# EAGLE design BMS (EAGLE 8.5.0)
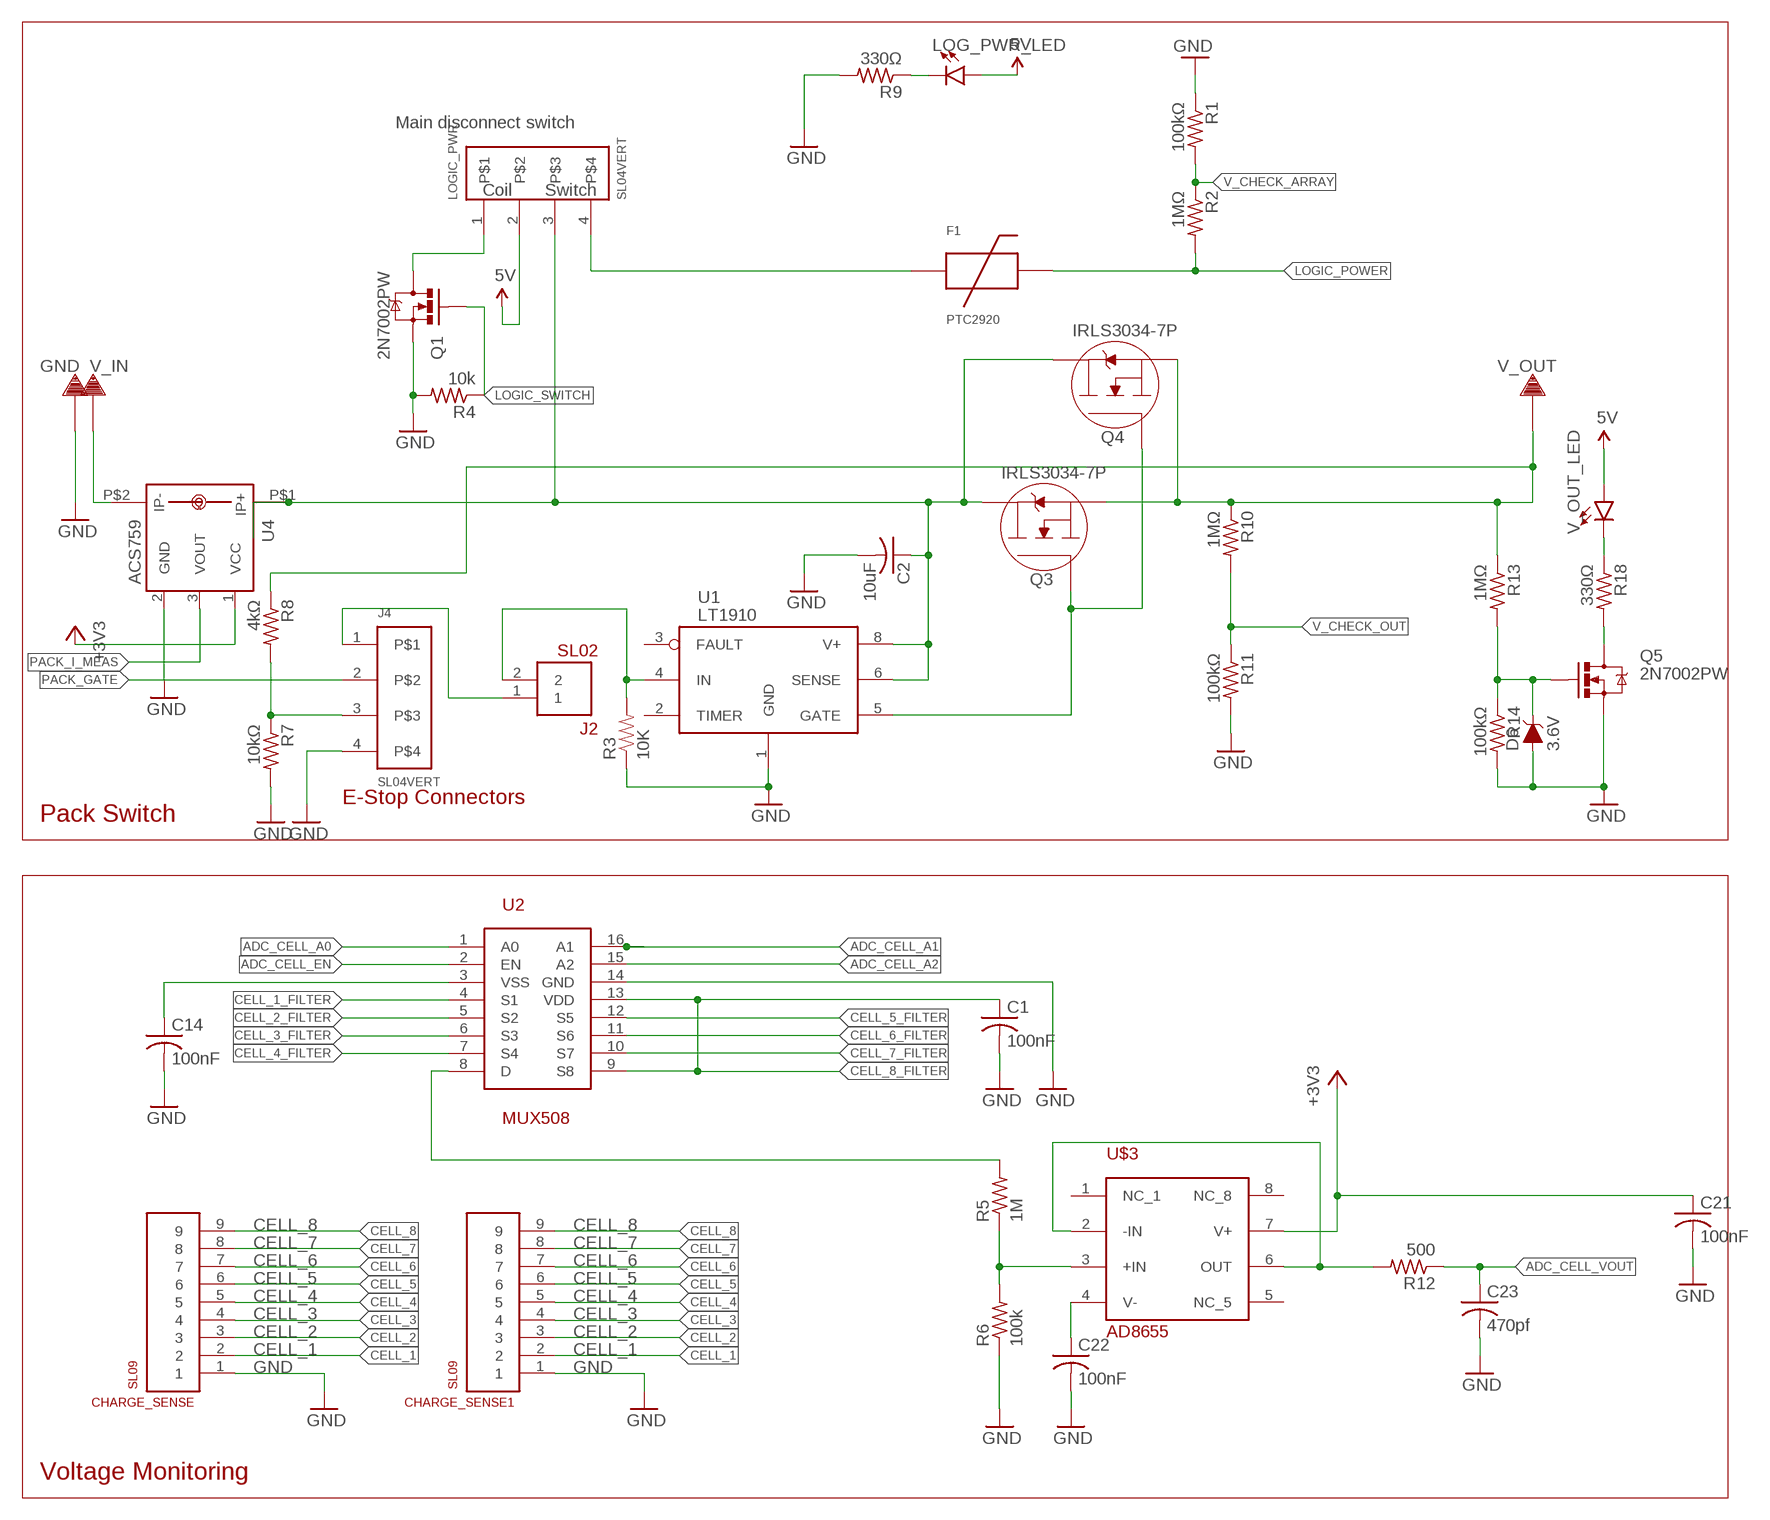
[diagram p0: schematic, sheet 1, part 1 of 2]
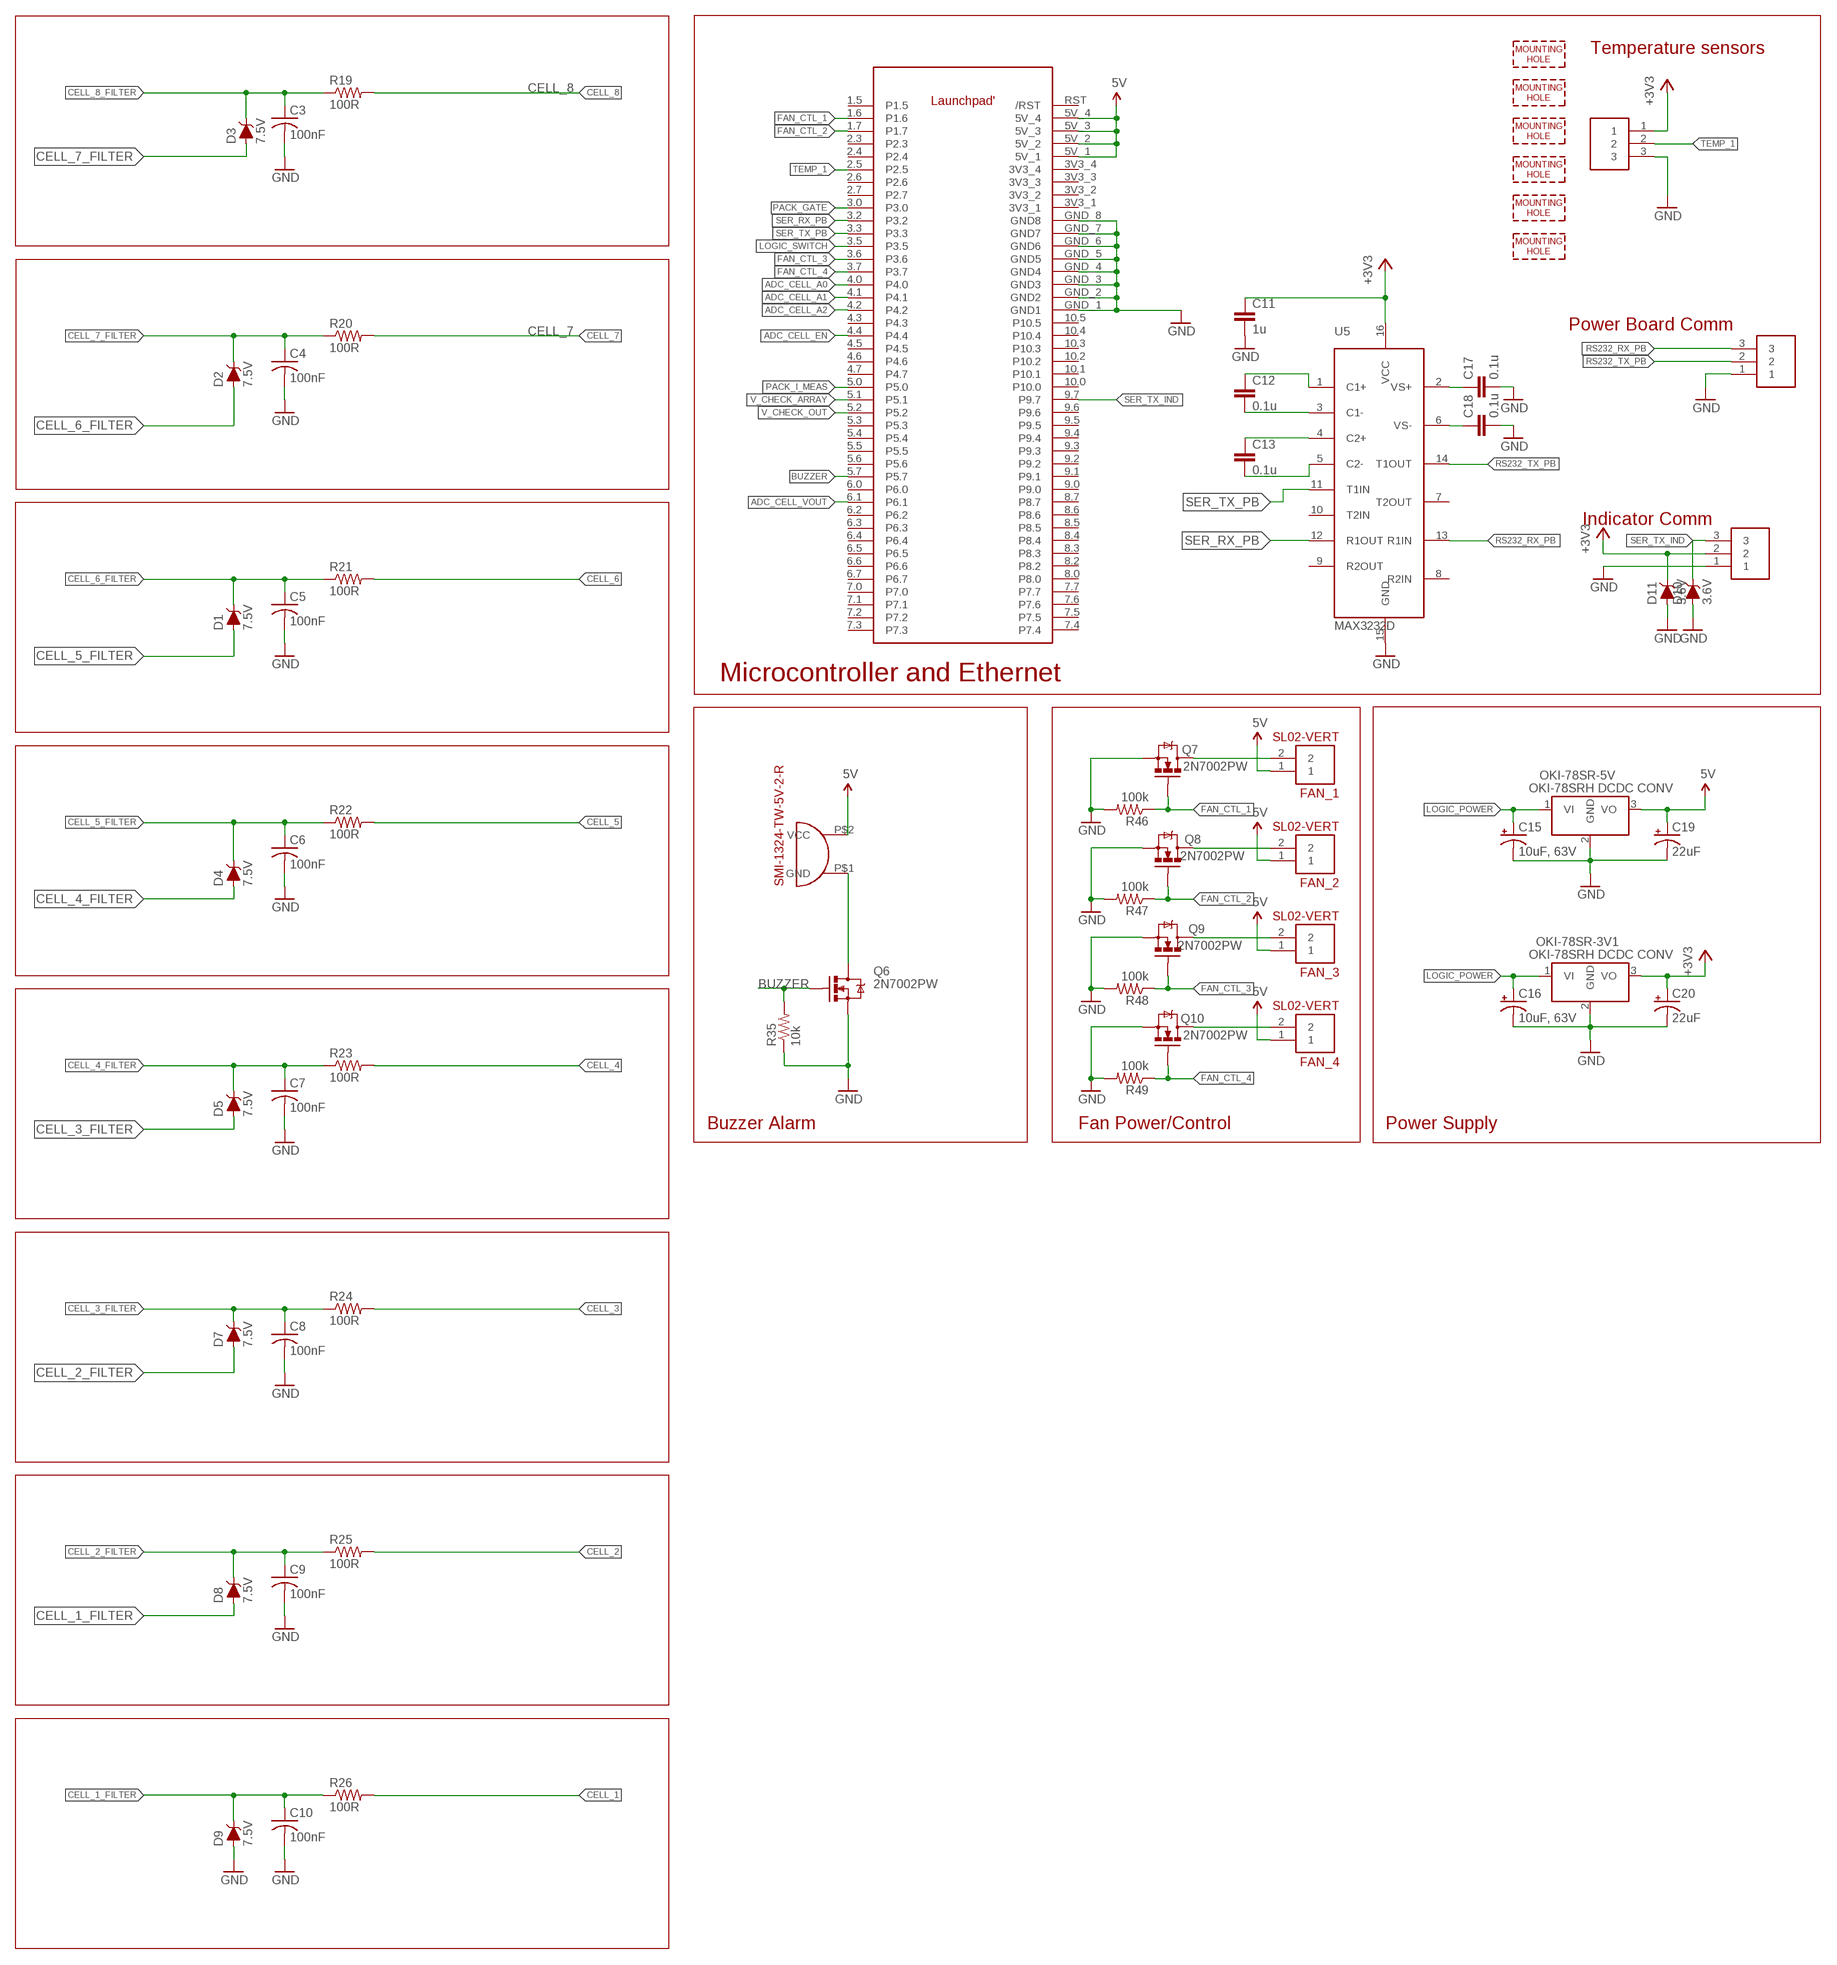
[diagram p1: schematic, sheet 1, part 2 of 2]

## Parts
C1  100nF  C-USC0603  [C0603]
C2  10uF  C-USC0805  [C0805]
C3  100nF  C-USC0603  [C0603]
C4  100nF  C-USC0603  [C0603]
C5  100nF  C-USC0603  [C0603]
C6  100nF  C-USC0603  [C0603]
C7  100nF  C-USC0603  [C0603]
C8  100nF  C-USC0603  [C0603]
C9  100nF  C-USC0603  [C0603]
C10  100nF  C-USC0603  [C0603]
C11  1u  CAP0805  [0805]
C12  0.1u  CAP0805  [0805]
C13  0.1u  CAP0805  [0805]
C14  100nF  C-USC0603  [C0603]
C15  10uF, 63V  CPOL-USD  [PANASONIC_D]
C16  10uF, 63V  CPOL-USD  [PANASONIC_D]
C17  0.1u  CAP0805  [0805]
C18  0.1u  CAP0805  [0805]
C19  22uF  CPOL-USD  [PANASONIC_D]
C20  22uF  CPOL-USD  [PANASONIC_D]
C21  100nF  C-USC0603  [C0603]
C22  100nF  C-USC0603  [C0603]
C23  470pf  C-USC0603  [C0603]
CHARGE_SENSE  SL09  [MOLEX-70543-0008]
CHARGE_SENSE1  SL09  [MOLEX-70543-0008]
D1  7.5V  DIODE-ZENER-BZT52C3V6S  [SOD-323]
D2  7.5V  DIODE-ZENER-BZT52C3V6S  [SOD-323]
D3  7.5V  DIODE-ZENER-BZT52C3V6S  [SOD-323]
D4  7.5V  DIODE-ZENER-BZT52C3V6S  [SOD-323]
D5  7.5V  DIODE-ZENER-BZT52C3V6S  [SOD-323]
D6  3.6V  DIODE-ZENER-BZT52C3V6S  [SOD-323]
D7  7.5V  DIODE-ZENER-BZT52C3V6S  [SOD-323]
D8  7.5V  DIODE-ZENER-BZT52C3V6S  [SOD-323]
D9  7.5V  DIODE-ZENER-BZT52C3V6S  [SOD-323]
D10  3.6V  DIODE-ZENER-BZT52C3V6S  [SOD-323]
D11  3.6V  DIODE-ZENER-BZT52C3V6S  [SOD-323]
F1  PTC2920  [2920]
FAN_1  SL02-VERT  [MOLEX-70543-0001]
FAN_2  SL02-VERT  [MOLEX-70543-0001]
FAN_3  SL02-VERT  [MOLEX-70543-0001]
FAN_4  SL02-VERT  [MOLEX-70543-0001]
GND  TERMINAL_HOLE  [LARGE_TERMINAL_HOLE]
H1  MOUNTING_HOLE#4  [#4_SCREW]
H2  MOUNTING_HOLE#4  [#4_SCREW]
H3  MOUNTING_HOLE#4  [#4_SCREW]
H4  MOUNTING_HOLE#4  [#4_SCREW]
H5  MOUNTING_HOLE#4  [#4_SCREW]
H6  MOUNTING_HOLE#4  [#4_SCREW]
IC2  SMI-1324-TW-5V-2-R  [SMI-1324-TW-5V-2-R]
J1  SL03  [MOLEX-70543-0002]
J2  SL02  [MOLEX-70543-0001]
J4  SL04VERT  [MOLEX-70543-0003]
LOG_PWR_LED  LED1206  [LED-1206]
LOGIC_PWR  SL04VERT  [MOLEX-70543-0003]
OKI-78SR-3V1  Q_OKI-78SR12  Q_OKI-78SR  [OKI-78SRH]
OKI-78SR-5V  Q_OKI-78SR5  Q_OKI-78SR  [OKI-78SRH]
Q1  2N7002PW  MOSFET-NCHANNEL2N7002PW  [SOT323]
Q3  IRLS3034-7P  [D2PAK-7]
Q4  IRLS3034-7P  [D2PAK-7]
Q5  2N7002PW  MOSFET-NCHANNEL2N7002PW  [SOT323]
Q6  2N7002PW  MOSFET-NCHANNEL2N7002PW  [SOT323]
Q7  2N7002PW  MOSFET-NCHANNEL2N7002PW  [SOT323]
Q8  2N7002PW  MOSFET-NCHANNEL2N7002PW  [SOT323]
Q9  2N7002PW  MOSFET-NCHANNEL2N7002PW  [SOT323]
Q10  2N7002PW  MOSFET-NCHANNEL2N7002PW  [SOT323]
R1  100kΩ  R-US_R0805  [R0805]
R2  1MΩ  R-US_R0805  [R0805]
R3  10K  10KOHM-1/10W-1%(0603)0603  [0603-RES]
R4  10k  R-US_R0805  [R0805]
R5  1M  R-US_M1206  [M1206]
R6  100k  R-US_M1206  [M1206]
R7  10kΩ  R-US_R0805  [R0805]
R8  4kΩ  R-US_R0805  [R0805]
R9  330Ω  R-US_R0805  [R0805]
R10  1MΩ  R-US_R0805  [R0805]
R11  100kΩ  R-US_R0805  [R0805]
R12  500  R-US_M1206  [M1206]
R13  1MΩ  R-US_R0805  [R0805]
R14  100kΩ  R-US_R0805  [R0805]
R18  330Ω  R-US_R0805  [R0805]
R19  100R  R-US_R0603  [R0603]
R20  100R  R-US_R0603  [R0603]
R21  100R  R-US_R0603  [R0603]
R22  100R  R-US_R0603  [R0603]
R23  100R  R-US_R0603  [R0603]
R24  100R  R-US_R0603  [R0603]
R25  100R  R-US_R0603  [R0603]
R26  100R  R-US_R0603  [R0603]
R35  10k  R-US_R0805  [R0805]
R46  100k  R-US_R0805  [R0805]
R47  100k  R-US_R0805  [R0805]
R48  100k  R-US_R0805  [R0805]
R49  100k  R-US_R0805  [R0805]
RS232_PB  SL03  [MOLEX-70543-0002]
TEMP_1  SL03  [MOLEX-70543-0002]
U1  LT1910  [SO8]
U2  MUX508  [SOIC16]
U3  MSP430R401R  [MSP432R401R-LAUNCHPAD]
U4  ACS759  [ACS-PFF-LEADFORM]
U5  MAX3232D  [SOIC16]
U$3  AD8655  [SOIC8]
V_IN  TERMINAL_HOLE  [LARGE_TERMINAL_HOLE]
V_OUT  TERMINAL_HOLE  [LARGE_TERMINAL_HOLE]
V_OUT_LED  LED1206  [LED-1206]

## Nets
5V: C19.+ FAN_1.1 FAN_2.1 FAN_3.1 FAN_4.1 IC2.P$2(VCC) LOG_PWR_LED.A LOGIC_PWR.2 OKI-78SR-5V.3(VO) U3.5V_1 U3.5V_2 U3.5V_3 U3.5V_4 V_OUT_LED.A
+3V3: C11.1 C20.+ C21.1 D11.C J1.2 OKI-78SR-3V1.3(VO) TEMP_1.1 U4.1(VCC) U5.16(VCC) U$3.7(V+)
ADC_CELL_A0: U2.1(A0) U3.4.0
ADC_CELL_A1: U2.16(A1) U3.4.1
ADC_CELL_A2: U2.15(A2) U3.4.2
ADC_CELL_EN: U2.2(EN) U3.4.4
ADC_CELL_VIN: R5.1 R6.2 U$3.3(+IN)
ADC_CELL_VOUT: C23.1 R12.1 U3.6.1
BUZZER: Q6.1(G) R35.2 U3.5.7
CELL_1: CHARGE_SENSE1.2 CHARGE_SENSE.2 R26.2
CELL_1_FILTER: C10.1 D8.A D9.C R26.1 U2.4(S1)
CELL_2: CHARGE_SENSE1.3 CHARGE_SENSE.3 R25.2
CELL_2_FILTER: C9.1 D7.A D8.C R25.1 U2.5(S2)
CELL_3: CHARGE_SENSE1.4 CHARGE_SENSE.4 R24.2
CELL_3_FILTER: C8.1 D5.A D7.C R24.1 U2.6(S3)
CELL_4: CHARGE_SENSE1.5 CHARGE_SENSE.5 R23.2
CELL_4_FILTER: C7.1 D4.A D5.C R23.1 U2.7(S4)
CELL_5: CHARGE_SENSE1.6 CHARGE_SENSE.6 R22.2
CELL_5_FILTER: C6.1 D1.A D4.C R22.1 U2.12(S5)
CELL_6: CHARGE_SENSE1.7 CHARGE_SENSE.7 R21.2
CELL_6_FILTER: C5.1 D1.C D2.A R21.1 U2.11(S6)
CELL_7: CHARGE_SENSE1.8 CHARGE_SENSE.8 R20.2
CELL_7_FILTER: C4.1 D2.C D3.A R20.1 U2.10(S7)
CELL_8: CHARGE_SENSE1.9 CHARGE_SENSE.9 R19.2
CELL_8_FILTER: C1.1 C3.1 D3.C R19.1 U2.9(S8) U2.13(VDD)
FAN_CTL_1: Q7.1(G) R46.1 U3.1.6
FAN_CTL_2: Q8.1(G) R47.1 U3.1.7
FAN_CTL_3: Q9.1(G) R48.1 U3.3.6
FAN_CTL_4: Q10.1(G) R49.1 U3.3.7
GND: C1.2 C2.2 C3.2 C4.2 C5.2 C6.2 C7.2 C8.2 C9.2 C10.2 C11.2 C14.2 C15.- C16.- C17.2 C18.2 C19.- C20.- C21.2 C22.2 C23.2 CHARGE_SENSE1.1 CHARGE_SENSE.1 D6.A D9.A D10.A D11.A GND.P$1 J1.1 J4.4 OKI-78SR-3V1.2(GND) OKI-78SR-5V.2(GND) Q1.2(S) Q5.2(S) Q6.2(S) Q7.2(S) Q8.2(S) Q9.2(S) Q10.2(S) R1.1 R3.1 R4.2 R6.1 R7.2 R9.2 R11.2 R14.2 R35.1 R46.2 R47.2 R48.2 R49.2 RS232_PB.1 TEMP_1.3 U1.1(GND) U2.14(GND) U3.GND_1(GND1) U3.GND_2(GND2) U3.GND_3(GND3) U3.GND_4(GND4) U3.GND_5(GND5) U3.GND_6(GND6) U3.GND_7(GND7) U3.GND_8(GND8) U4.2(GND) U5.15(GND)
LOGIC_POWER: C15.+ C16.+ F1.P$2 OKI-78SR-3V1.1(VI) OKI-78SR-5V.1(VI) R2.2
LOGIC_SWITCH: Q1.1(G) R4.1 U3.3.5
N$1: J2.1 J4.1
N$2: Q5.3(D) R18.2
N$3: C14.1 U2.3(VSS)
N$4: LOG_PWR_LED.C R9.1
N$5: J2.2 R3.2 U1.4(IN)
N$6: C22.1 U$3.4(V-)
N$7: LOGIC_PWR.1 Q1.3(D)
N$8: C13.1 U5.4(C2+)
N$9: R18.1 V_OUT_LED.C
N$10: D6.C Q5.1(G) R13.2 R14.1
N$11: J4.3 R7.1 R8.2
N$12: C13.2 U5.5(C2-)
N$14: C17.1 U5.2(VS+)
N$15: F1.P$1 LOGIC_PWR.4
N$22: R5.2 U2.8(D)
N$34: Q3.1(GATE) Q4.1(GATE) U1.5(GATE)
N$40: C12.1 U5.1(C1+)
N$41: C2.1 LOGIC_PWR.3 Q3.PAD(DRAIN) Q4.PAD(DRAIN) U1.6(SENSE) U1.8(V+) U4.P$1(IP+)
N$42: C12.2 U5.3(C1-)
N$45: C18.1 U5.6(VS-)
N$63: IC2.P$1(GND) Q6.3(D)
N$66: FAN_1.2 Q7.3(D)
N$70: FAN_2.2 Q8.3(D)
N$71: FAN_3.2 Q9.3(D)
N$72: FAN_4.2 Q10.3(D)
PACK_GATE: J4.2 U3.3.0
PACK_I_MEAS: U3.5.0 U4.3(VOUT)
RC_FILTER: R12.2 U$3.2(-IN) U$3.6(OUT)
RS232_RX_PB: RS232_PB.3 U5.13(R1IN)
RS232_TX_PB: RS232_PB.2 U5.14(T1OUT)
SER_RX_PB: U3.3.2 U5.12(R1OUT)
SER_TX_IND: D10.C J1.3 U3.9.7
SER_TX_PB: U3.3.3 U5.11(T1IN)
TEMP_1: TEMP_1.2 U3.2.5
V_CHECK_ARRAY: R1.2 R2.1 U3.5.1
V_CHECK_OUT: R10.2 R11.1 U3.5.2
V_IN: U4.P$2(IP-) V_IN.P$1
V_OUT: Q3.2(SOURCE) Q3.3(SOURCE) Q3.4(SOURCE) Q3.5(SOURCE) Q3.6(SOURCE) Q4.2(SOURCE) Q4.3(SOURCE) Q4.4(SOURCE) Q4.5(SOURCE) Q4.6(SOURCE) R8.1 R10.1 R13.1 V_OUT.P$1
Unconnected: U1.2(TIMER) U1.3(FAULT) U3.1.5 U3.2.3 U3.2.4 U3.2.6 U3.2.7 U3.3V3_1 U3.3V3_2 U3.3V3_3 U3.3V3_4 U3.4.3 U3.4.5 U3.4.6 U3.4.7 U3.5.3 U3.5.4 U3.5.5 U3.5.6 U3.6.0 U3.6.2 U3.6.3 U3.6.4 U3.6.5 U3.6.6 U3.6.7 U3.7.0 U3.7.1 U3.7.2 U3.7.3 U3.7.4 U3.7.5 U3.7.6 U3.7.7 U3.8.0 U3.8.2 U3.8.3 U3.8.4 U3.8.5 U3.8.6 U3.8.7 U3.9.0 U3.9.1 U3.9.2 U3.9.3 U3.9.4 U3.9.5 U3.9.6 U3.10.0 U3.10.1 U3.10.2 U3.10.3 U3.10.4 U3.10.5 U3.RST(/RST) U5.7(T2OUT) U5.8(R2IN) U5.9(R2OUT) U5.10(T2IN) U$3.1(NC_1) U$3.5(NC_5) U$3.8(NC_8)

## Notes on the sheet
- Temperature sensors
- Main disconnect switch
- Coil | Switch
- Power Board Comm
- Indicator Comm
- E-Stop Connectors
- Pack Switch
- Microcontroller and Ethernet
- Voltage Monitoring
- Buzzer Alarm | Fan Power/Control | Power Supply

## Library data of the parts
C1-C10 C14 C21-C23 = rcl:C-US: CAPACITOR, American symbol; SPICEPREFIX: C
C11-C13 C17 C18 = SparkFun-Passives:CAP: Capacitor Standard 0603 ceramic capacitor, and 0.1" leaded capacitor.
C15 C16 C19 C20 = rcl:CPOL-US: POLARIZED CAPACITOR, American symbol; SPICEPREFIX: C
CHARGE_SENSE CHARGE_SENSE1 = MRDT-Connectors:SL09
D1-D5 D7-D9 = SparkFun-DiscreteSemi:DIODE-ZENER: Zener Diode A Zener diode allows current to flow from its anode to its cathode like a normal semiconductor diode, but it also permits current to flow in the reverse direction when its "Zener voltage" is reached. - WIkipedia; PROD_ID: DIO-08199; VALUE: 3.6V
D6 D10 D11 = SparkFun-DiscreteSemi:DIODE-ZENER: Zener Diode A Zener diode allows current to flow from its anode to its cathode like a normal semiconductor diode, but it also permits current to flow in the reverse direction when its "Zener voltage" is reached. - WIkipedia; PROD_ID: DIO-08199
F1 = 2016PowerPackLibraries:PTC2920
FAN_1-FAN_4 = MRDT-Connectors:SL02-VERT
GND V_IN V_OUT = MRDT-2015-PowerBoard:TERMINAL_HOLE
H1-H6 = MRDT-Hardware:MOUNTING_HOLE: Mounting hole for M6 bolt. Standard use mounting hole for: Tiva C Connected - M6 Anderson Powerpole Mounting Wing - M8 Most frame-mounted PCB's - M8
IC2 = MRDT-2017-BMS:SMI-1324-TW-5V-2-R
J1 RS232_PB TEMP_1 = MRDT-Connectors:SL03: Molex 3-pin SL connector Locking 3 pin connector with standard header spacing. Backward compatible with standard RC servo connectors.
J2 = MRDT-Connectors:SL02
J4 LOGIC_PWR = MRDT-Connectors:SL04
LOG_PWR_LED V_OUT_LED = SparkFun-LED:LED: LED (Generic) Standard schematic elements and footprints for 5mm, 3mm, 1206, and 0603 sized LEDs. Generic LEDs with no color specified.
OKI-78SR-3V1 OKI-78SR-5V = MRDT-2015-PowerBoard:Q_OKI-78SR: 4.95W DC/DC Converter Manufacturer: Murata Part Number: OKI-78SR-5/1.5-W36H-C OKI-78SR-3.3/1.5-W36H-C
Q1 Q5-Q10 = SparkFun-DiscreteSemi:MOSFET-NCHANNEL: Common NMOSFET Parts MFG P/N Store ID Prod ID FDD8780 TRANS-09984 SI7820DN TRANS-11055 FDS6630A IC-08089 2N7002PW TRANS-11151 FQP30N06L COM-10213 TRANS-10060 BSS123LT1G TRANS-08345 BSS138 TRANS-00830 BS170 2N7000; PROD_ID: TRANS-11151
Q3 Q4 = MRDT-2015-BMS:IRLS3034-7P: High-current SMD MOSFET
R1 R2 R4-R14 R18-R26 R35 R46-R49 = rcl:R-US_: RESISTOR, American symbol; SPICEPREFIX: R
R3 = SparkFun-Resistors:10KOHM-1/10W-1%(0603): RES-00824; PROD_ID: RES-00824
U1 = MRDT-2015-PowerBoard:LT1910
U2 = MRDT-ICs:MUX508
U3 = MRDT-Microcontrollers:MSP430R401R
U4 = MRDT-ICs:ACS759
U5 = MRDT-ICs:MAX*232; OPERATING_VOLTAGE: 3V3
U$3 = MRDT-ICs:AD8655

## Net classes
0 default: width 0.406 mm, clearance 0.152 mm

## Board
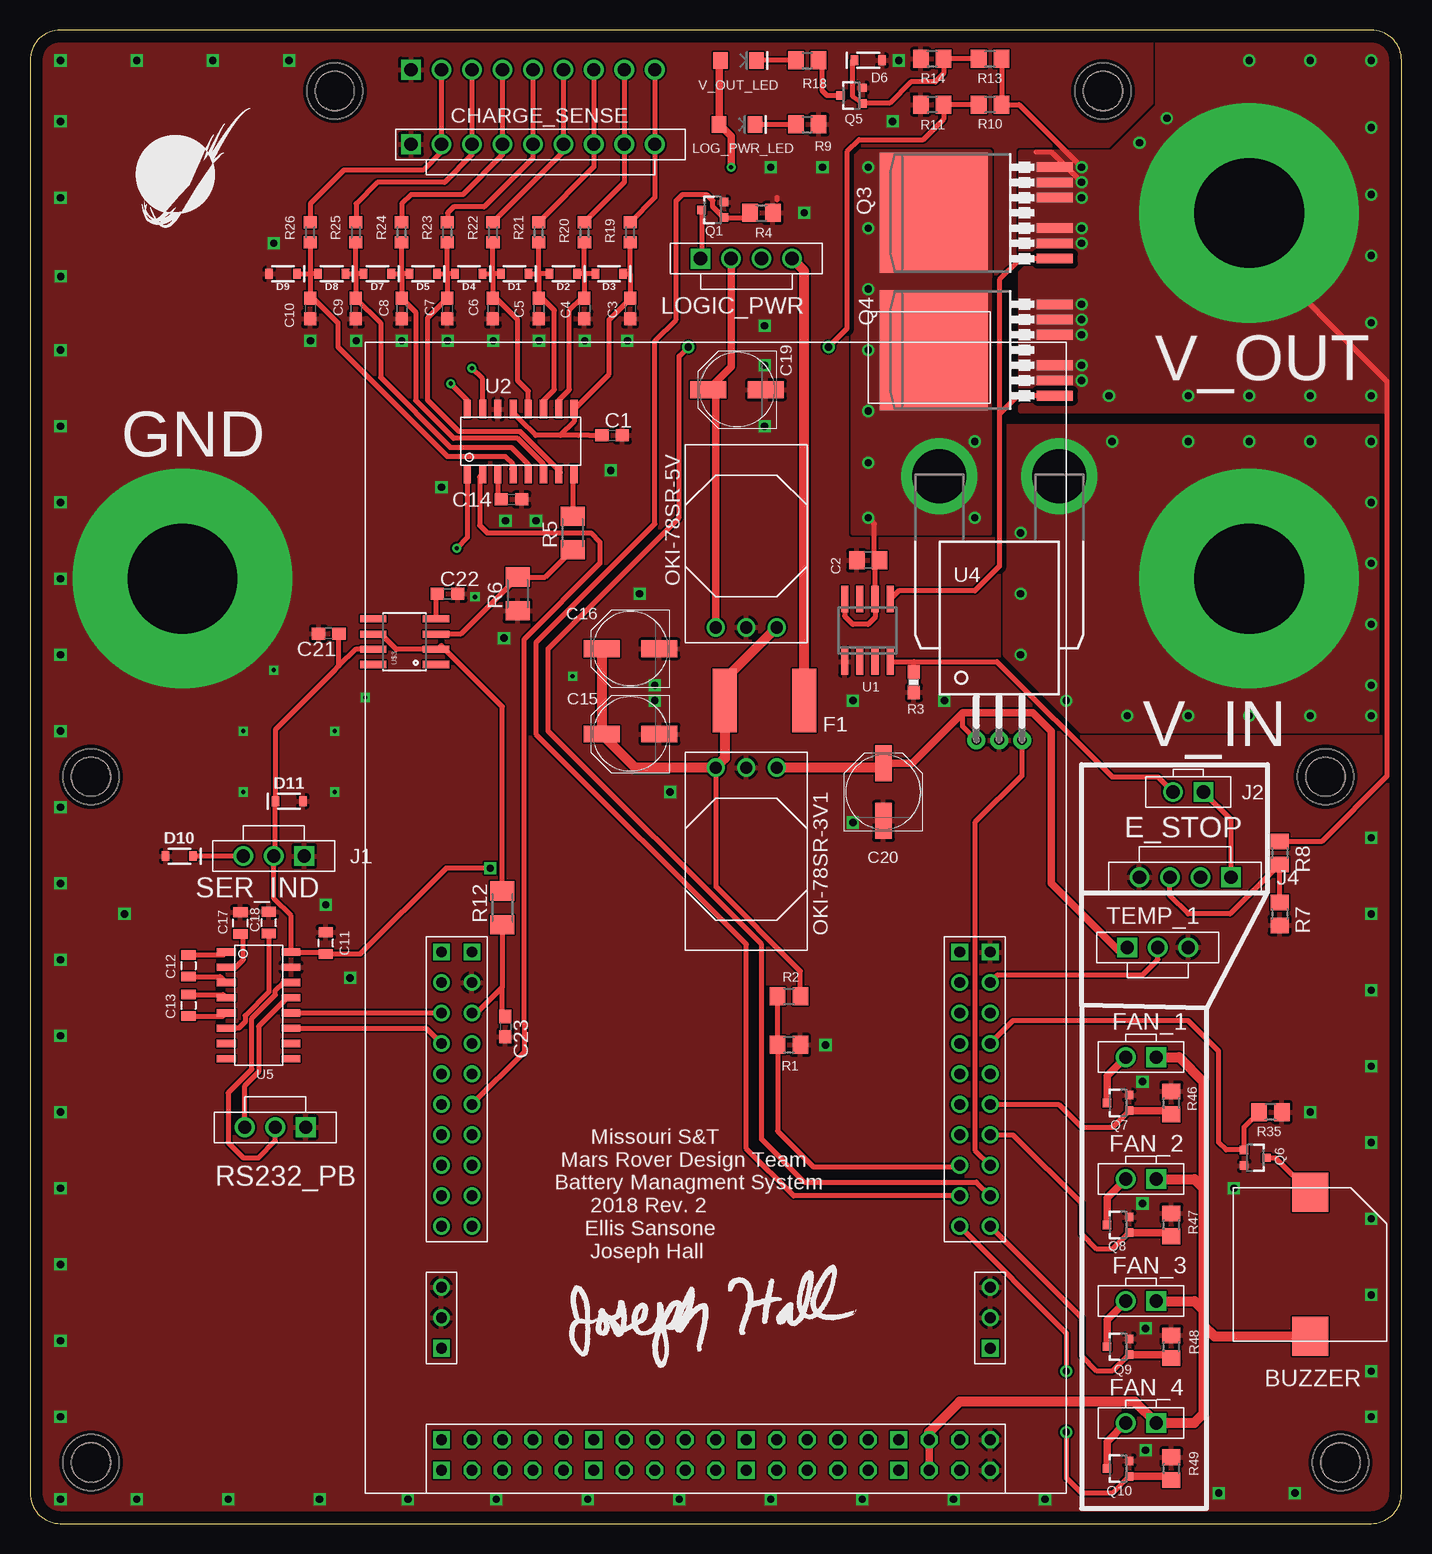
[diagram p2: board, top side]
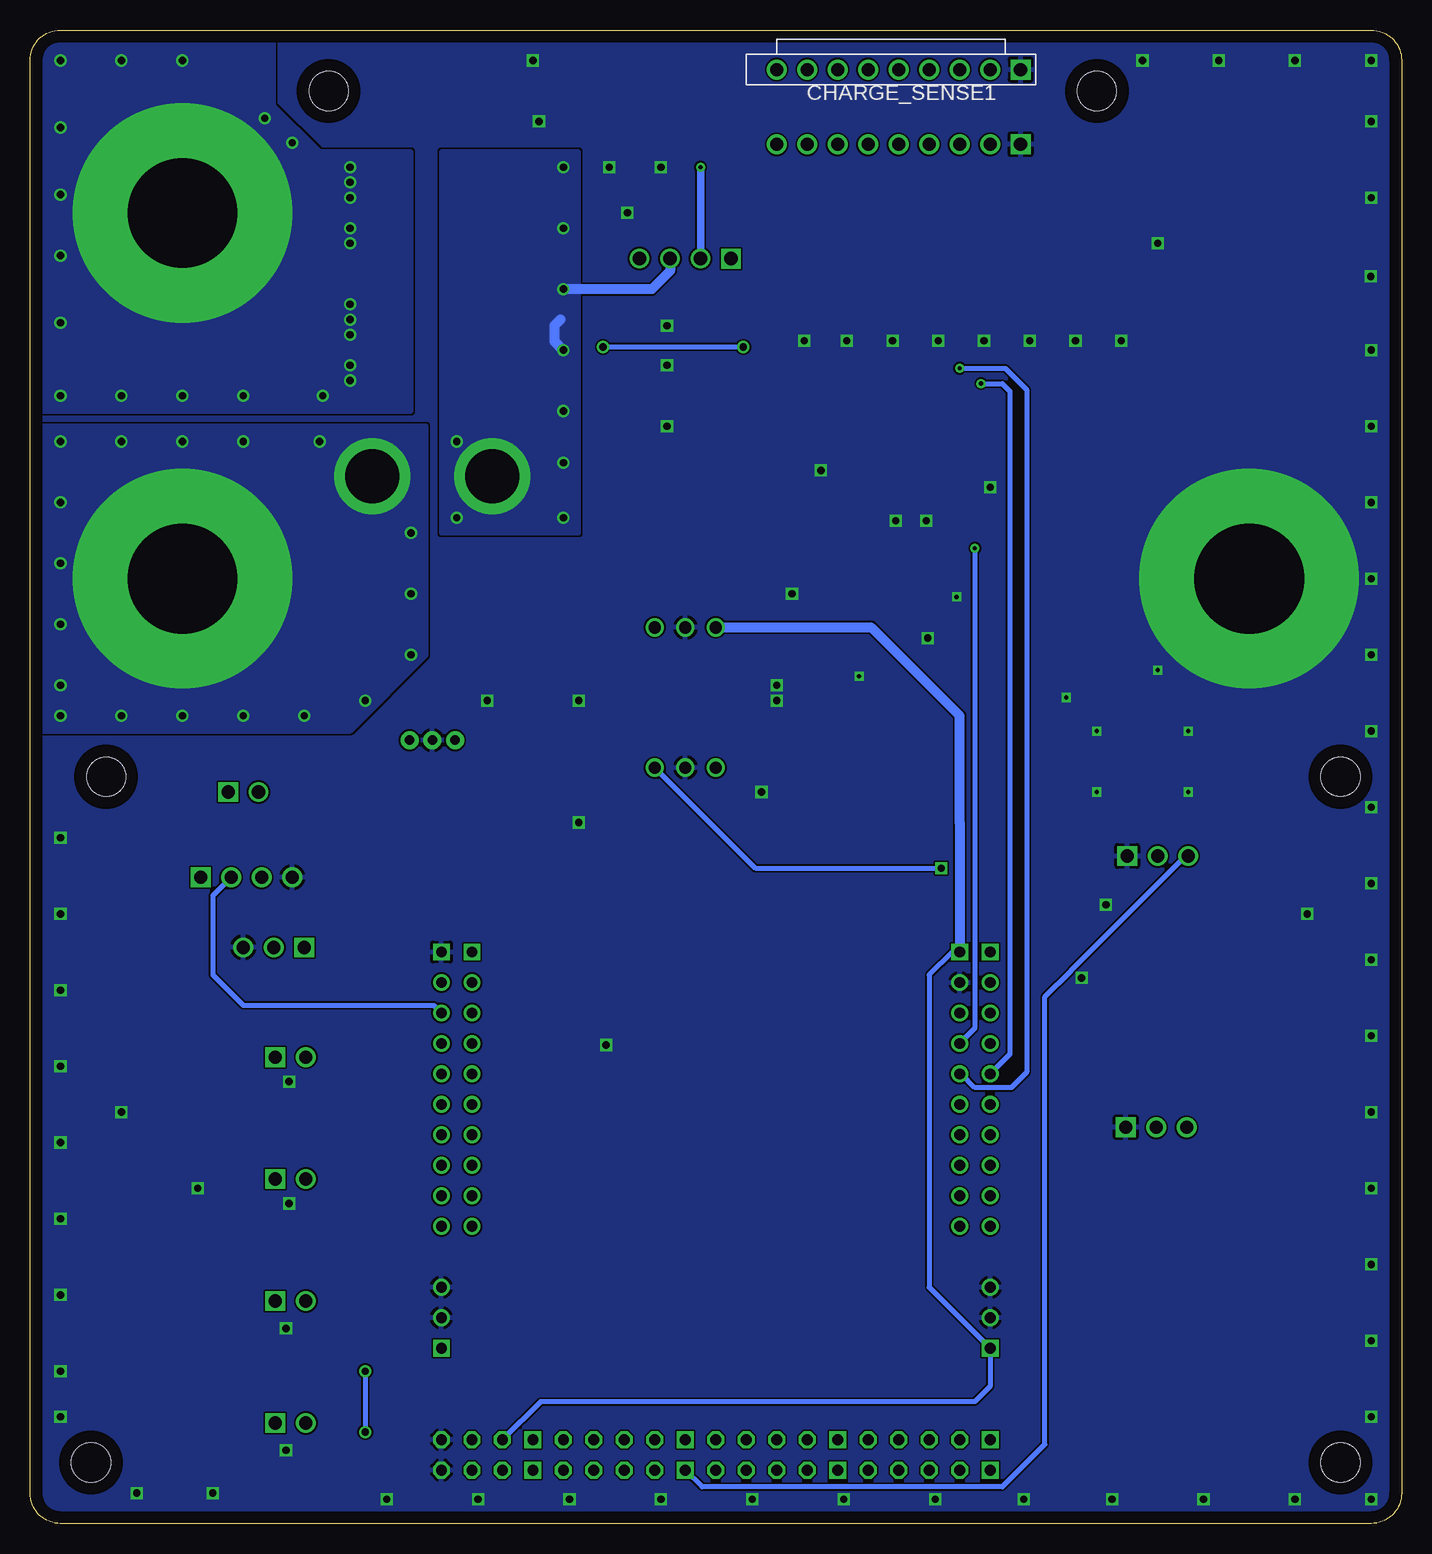
[diagram p3: board, bottom side, seen from below]

Size 114.3 x 124.46 mm. Coordinates in mm from the lower left corner, seen from the top.
Outline: 0,121.92 0,2.54 arc90 2.54,0 111.76,0 arc90 114.3,2.54 114.3,121.92 arc90 111.76,124.46 2.54,124.46 arc90 0,121.92
Copper layers (1*16): Top 0.035mm / dielectric 1.5mm / Bottom 0.035mm
Design rules "advanced_circuits_standard": minimum track width 5mil, minimum drill 10mil, track to track 5mil, track to pad 5mil, pad to pad 5mil, via to via 5mil, smd to smd 5mil, copper to edge 40mil, drill to drill 5mil, minimum pad ring 10mil, minimum via ring 8mil, stop-mask expansion 4mil, vias tented up to drill 0mil, thermal gap 10mil

### Footprints (pad centres in the part's own frame; a part is rotated, then mirrored left to right if it is on the bottom)
C0603 = smd 1.1 x 1: 1 -0.85,0; 2 0.85,0
C0805 = smd 1.3 x 1.5: 1 -0.95,0; 2 0.95,0
0805 = smd 0.8 x 1.2: 1 -0.9,0; 2 0.9,0
PANASONIC_D = smd 3 x 1.4: + 2.4,0; - -2.4,0
MOLEX-70543-0008 = drill 1.1 square: 1 10.16,0 | drill 1.1: 2 7.62,0; 3 5.08,0; 4 2.54,0; 5 0,0; 6 -2.54,0; 7 -5.08,0; 8 -7.62,0; 9 -10.16,0
SOD-323 = smd 0.63 x 0.83: A 1.15,0; C -1.15,0
2920 = smd 2 x 5.3: P$1 0,0; P$2 6.6,0
MOLEX-70543-0001 = drill 1.1 square: 1 1.27,0 | drill 1.1: 2 -1.27,0
LARGE_TERMINAL_HOLE = drill 9.144 pad 18.288: P$1 0,0
#4_SCREW = hole 3.264: 0,0
SMI-1324-TW-5V-2-R = smd 3.25 x 3: P$1 6,0; P$2 -6,0
MOLEX-70543-0002 = drill 1.1 square: 1 2.54,0 | drill 1.1: 2 0,0; 3 -2.54,0
MOLEX-70543-0003 = drill 1.1 square: 1 3.81,0 | drill 1.1: 2 1.27,0; 3 -1.27,0; 4 -3.81,0
LED-1206 = smd 1.2 x 1.4: A -1.5,0; C 1.5,0
OKI-78SRH = drill 1.016: 1 2.54,0; 2 0,0; 3 -2.54,0
SOT323 = smd 0.7 x 0.7: 1 -0.65,-0.925; 2 0.65,-0.925; 3 0,0.925
D2PAK-7 = smd 0.8 x 3: 1 -3.81,-9.207; 2 -2.54,-9.207; 3 -1.27,-9.207; 4 1.27,-9.207; 5 2.54,-9.207; 6 3.81,-9.207 | smd 10 x 9: PAD 0,0.895
R0805 = smd 1.3 x 1.5: 1 -0.95,0; 2 0.95,0
0603-RES = smd 1.1 x 1: 1 -0.85,0; 2 0.85,0
M1206 = smd 1.6 x 2: 1 -1.4,0; 2 1.4,0
R0603 = smd 1 x 1.1: 1 -0.85,0; 2 0.85,0
SO8 = smd 0.6 x 2.2: 1 -1.905,-2.6; 2 -0.635,-2.6; 3 0.635,-2.6; 4 1.905,-2.6; 5 1.905,2.6; 6 0.635,2.6; 7 -0.635,2.6; 8 -1.905,2.6
SOIC16 = smd 0.6 x 1.55: 1 -4.445,-2.7; 2 -3.175,-2.7; 3 -1.905,-2.7; 4 -0.635,-2.7; 5 0.635,-2.7; 6 1.905,-2.7; 7 3.175,-2.7; 8 4.445,-2.7; 9 4.445,2.7; 10 3.175,2.7; 11 1.905,2.7; 12 0.635,2.7; 13 -0.635,2.7; 14 -1.905,2.7; 15 -3.175,2.7; 16 -4.445,2.7
MSP432R401R-LAUNCHPAD = drill 0.9: 1.5 6.35,29.845; 1.6 52.07,32.385; 1.7 52.07,29.845; 2.3 49.53,29.845; 2.4 49.53,40.005; 2.5 52.07,42.545; 2.6 49.53,42.545; 3.0 52.07,40.005; 3.2 6.35,40.005; 3.3 6.35,37.465; 3.5 49.53,24.765; 3.6 52.07,22.225; 3.7 49.53,22.225; 4.0 8.89,37.465; 4.1 6.35,34.925; 4.2 8.89,34.925; 4.3 6.35,32.385; 4.4 8.89,32.385; 4.5 8.89,29.845; 4.6 6.35,27.305; 4.7 8.89,27.305; 5.0 52.07,27.305; 5.1 49.53,27.305; 5.2 52.07,24.765; 5.4 8.89,24.765; 5.5 8.89,22.225; 5.6 49.53,37.465; 5.7 52.07,37.465; 6.0 6.35,42.545; 6.1 8.89,40.005; 6.4 6.35,22.225; 6.5 6.35,24.765; 6.6 49.53,34.925; 6.7 49.53,32.385; GND_1 8.89,42.545; GND_3 6.35,17.145; GND_4 52.07,17.145; GND_5 6.35,14.605; GND_6 52.07,14.605; RST 52.07,34.925 | drill 0.9 square: 2.7 49.53,45.085; 3V3_1 6.35,45.085; 3V3_2 52.07,12.065; 5V_1 8.89,45.085; 5V_2 6.35,12.065; 6.2 19.05,4.445; 8.0 31.75,4.445; 8.5 6.35,4.445; 8.6 6.35,1.905; 9.3 19.05,1.905; 9.7 31.75,1.905; 10.4 44.45,4.445; 10.5 44.45,1.905; GND_2 52.07,45.085 | drill 0.9 octagon: 3V3_3 49.53,4.445; 3V3_4 49.53,1.905; 5.3 16.51,1.905; 5V_3 46.99,4.445; 5V_4 46.99,1.905; 6.3 21.59,1.905; 7.0 26.67,1.905; 7.1 24.13,4.445; 7.2 24.13,1.905; 7.3 21.59,4.445; 7.4 34.29,4.445; 7.5 34.29,1.905; 7.6 36.83,4.445; 7.7 36.83,1.905; 8.2 13.97,4.445; 8.3 13.97,1.905; 8.4 11.43,4.445; 8.7 8.89,1.905; 9.0 8.89,4.445; 9.1 11.43,1.905; 9.2 16.51,4.445; 9.4 26.67,4.445; 9.5 29.21,1.905; 9.6 29.21,4.445; 10.0 39.37,4.445; 10.1 39.37,1.905; 10.2 41.91,4.445; 10.3 41.91,1.905; GND_7 52.07,4.445; GND_8 52.07,1.905
ACS-PFF-LEADFORM = drill 0.8 pad 1.5: 1 -1.9,0; 2 0,0; 3 1.9,0 | drill 4.5 pad 6.35: P$1 -5,22; P$2 5,22
SOIC8 = smd 0.6 x 2.2: 1 0.457,-0.813; 2 1.727,-0.813; 3 2.997,-0.813; 4 4.267,-0.813; 5 4.267,4.419; 6 2.997,4.419; 7 1.727,4.419; 8 0.457,4.419

### Placement (x,y rotation side)
C1  48.51,90.68 0 top
C2  69.85,80.26 180 top
C3  50.01,101.26 270 top
C4  46.2,101.26 270 top
C5  42.39,101.26 270 top
C6  38.58,101.26 270 top
C7  34.77,101.26 270 top
C8  30.96,101.26 270 top
C9  27.15,101.26 270 top
C10  23.34,101.26 270 top
C11  24.65,48.37 90 top
C12  13.21,46.48 270 top
C13  13.21,43.18 270 top
C14  40.13,85.34 0 top
C15  50.04,65.79 180 top
C16  50.04,72.9 180 top
C17  17.53,50.04 90 top
C18  19.9,50.08 90 top
C19  58.93,94.49 180 top
C20  71.12,60.96 90 top
C21  24.89,74.17 180 top
C22  34.8,77.47 0 top
C23  39.62,41.4 270 top
CHARGE_SENSE  41.91,114.94 180 top
CHARGE_SENSE1  41.91,121.16 0 bottom
D1  40.39,104.14 180 top
D2  44.45,104.14 180 top
D3  48.26,104.14 180 top
D4  36.58,104.14 180 top
D5  32.77,104.14 180 top
D6  69.85,121.92 0 top
D7  28.96,104.14 180 top
D8  25.15,104.14 180 top
D9  21.08,104.14 180 top
D10  12.45,55.63 180 top
D11  21.59,60.2 0 top
F1  64.52,68.58 180 top
FAN_1  92.58,38.86 0 top
FAN_2  92.58,28.7 0 top
FAN_3  92.58,18.54 0 top
FAN_4  92.58,8.38 0 top
GND  12.7,78.74 0 top
H1  109.22,5.08 0 top
H2  5.08,5.08 0 top
H3  25.4,119.38 0 top
H4  89.41,119.38 0 top
H5  5.08,62.23 0 top
H6  107.95,62.23 0 top
IC2  106.68,21.59 90 top
J1  20.32,55.63 0 top
J2  96.52,60.96 0 top
J4  96.27,53.85 0 top
LOG_PWR_LED  58.93,116.59 0 top
LOGIC_PWR  59.69,105.41 180 top
OKI-78SR-3V1  59.69,62.99 180 top
OKI-78SR-5V  59.69,74.68 0 top
Q1  56.9,109.47 90 top
Q3  76.2,109.22 90 top
Q4  76.2,97.79 90 top
Q5  68.45,119 90 top
Q6  102.11,30.48 270 top
Q7  90.68,35.05 90 top
Q8  90.68,24.89 90 top
Q9  90.68,14.73 90 top
Q10  90.68,4.57 90 top
R1  63.25,39.88 180 top
R2  63.25,43.94 0 top
R3  73.66,70.1 90 top
R4  60.96,109.22 0 top
R5  45.21,82.55 90 top
R6  40.64,77.47 90 top
R7  104.14,50.8 270 top
R8  104.14,55.88 270 top
R9  64.77,116.59 0 top
R10  80.01,118.24 180 top
R11  75.18,118.24 180 top
R12  39.37,51.31 90 top
R13  80.01,122.05 180 top
R14  75.18,122.05 180 top
R18  64.77,121.92 0 top
R19  50.01,107.61 90 top
R20  46.2,107.61 90 top
R21  42.39,107.61 90 top
R22  38.58,107.61 90 top
R23  34.77,107.61 90 top
R24  30.96,107.61 90 top
R25  27.15,107.61 90 top
R26  23.34,107.61 90 top
R35  103.38,34.29 180 top
R46  95.12,35.05 90 top
R47  95.12,24.89 90 top
R48  95.12,14.73 90 top
R49  95.12,4.57 90 top
RS232_PB  20.45,33.02 0 top
TEMP_1  93.98,48.01 180 top
U1  69.79,74.43 0 top
U2  40.89,90.17 0 top
U3  27.94,2.54 0 top
U4  80.77,65.28 0 top
U5  19.05,43.18 270 top
U$1  [JOSEPH_HALL_SIGNATURE]  44.45,13.97 0 top
U$3  33.02,71.12 90 top
U$9  [MRDT_LOGO]  8.81,107.15 0 top
V_IN  101.6,78.74 270 top
V_OUT  101.6,109.22 0 top
V_OUT_LED  59.05,121.92 0 top

### Tracks (layer width: path | path; a pad name or v marks a point on that pad's centre or on a via)
5V  (via drill 0.35)
  Top 0.61: V_OUT_LED.A 57.4,121.77 57.43,121.75 LOG_PWR_LED.A 58.42,115.59 v58.42,113.03 | OKI-78SR-5V.3 57.15,93.87 C19.+ 58.42,96.38 LOGIC_PWR.2 | U3.5V_4 U3.5V_3
  Top 0.813: FAN_1.1 95.76,38.86 97.79,36.83 97.79,27.94 | 97.79,27.94 97.79,17.78 | FAN_2.1 97.03,28.7 97.79,27.94 | FAN_3.1 97.03,18.54 97.79,17.78 | IC2.P$2 98.71,15.59 97.79,16.51 | 97.79,17.78 97.79,16.51 | 97.79,16.51 97.79,9.14 97.03,8.38 FAN_4.1 92.08,10.16 77.47,10.16 74.93,7.62 U3.5V_3
  Bottom 0.406: U3.5V_1 37.47,47.62 39.37,45.72 39.37,19.68 U3.5V_2 34.29,11.43 35.56,10.16 71.75,10.16 U3.5V_3 | 36.83,59.69 36.83,58.42
  Bottom 0.61: LOGIC_PWR.2 v58.42,113.03
  Bottom 0.813: OKI-78SR-5V.3 44.2,74.68 36.83,67.31 36.83,58.42 U3.5V_1
+3V3  (via drill 0.6)
  Top 0.406: v38.35,54.61 34.68,54.61 27.54,47.47 C11.1 24.49,47.62 U5.16 21.75,50.64 20.32,52.07 J1.2 20.44,55.75 D11.C 20.44,66.16 25.4,71.12 25.74,71.46 | U$3.7 27.13,72.85 25.74,71.46 | U4.1 77.72,66.43 77.72,67.56 | 73.66,63.5 73.52,63.36 | 25.74,71.46 C21.1
  Top 0.61: TEMP_1.1 91.19,47.75 90.68,47.75 85.09,53.34 85.09,66.04 83.57,67.56 77.72,67.56 73.66,63.5 | 73.52,63.36 C20.+
  Top 0.813: OKI-78SR-3V1.3 70.75,62.99 C20.+
  Bottom 0.406: OKI-78SR-3V1.3 53.85,54.61 v38.35,54.61
ADC_CELL_A0  (via drill 0.35)
  Top 0.406: U2.1 36.45,82.17 v35.56,81.28
  Bottom 0.406: v35.56,81.28 35.56,41.27 U3.4.0
ADC_CELL_A1  (via drill 0.35)
  Top 0.406: U2.16 36.45,93.6 v35.05,95
  Bottom 0.406: v35.05,95 33.27,95 32.64,94.36 32.64,39.12 U3.4.1
ADC_CELL_A2  (via drill 0.35)
  Top 0.406: U2.15 37.72,95.38 v36.83,96.27
  Bottom 0.406: v36.83,96.27 33.02,96.27 31.24,94.49 31.24,37.59 32.51,36.32 35.56,36.32 36.7,37.47 U3.4.2
ADC_CELL_EN
  Top 0.406: U2.2 37.47,87.22 37.47,83.19 38.1,82.55 46.74,82.55 47.5,81.79 47.5,80 41.17,73.68 41.17,41.81 41.17,39.27 U3.4.4
ADC_CELL_VIN
  Top 0.406: R5.1 42.93,78.87 R6.2 35.89,74.12 U$3.3
ADC_CELL_VOUT
  Top 0.406: U3.6.1 37.21,42.55 39.37,44.7 | C23.1 39.37,42.51 39.37,44.7 | R12.1 39.37,44.7
BUZZER
  Top 0.406: U3.5.7 81.92,41.91 96.52,41.91 99.06,39.37 99.06,31.75 99.68,31.13 Q6.1 101.18,33.05 R35.2
CELL_1
  Top 0.406: CHARGE_SENSE1.2 CHARGE_SENSE.2 34.29,114.3 32.77,112.78 26.16,112.78 23.37,109.98 23.37,108.48 R26.2
CELL_1_FILTER
  Top 0.406: D9.C 23.34,104.14 | D8.A 23.34,104.14 | C10.1 23.62,102.11 | 23.62,102.11 25.65,100.08 25.65,98.04 34.8,88.9 39.62,88.9 40.26,88.27 U2.4 40.26,87.74 40.13,87.87 | R26.1 23.34,104.14 | 23.34,104.14 23.34,102.39 23.62,102.11
CELL_2
  Top 0.406: CHARGE_SENSE1.3 CHARGE_SENSE.3 | CHARGE_SENSE.3 36.83,114.3 | CHARGE_SENSE.3 36.83,114.05 34.54,111.76 28.96,111.76 27.18,109.98 27.18,108.48 R25.2
CELL_2_FILTER
  Top 0.406: 27.15,104.14 C9.1 29.21,100.05 29.21,95.5 35.05,89.66 40.13,89.66 41.53,88.27 U2.5 41.53,87.74 41.4,87.87 | 27.15,104.14 R25.1 | D8.C 27.15,104.14 | D7.A 27.15,104.14
CELL_3
  Top 0.406: CHARGE_SENSE1.4 CHARGE_SENSE.4 39.37,114.05 36.07,110.74 31.75,110.74 30.99,109.98 30.99,108.48 R24.2
CELL_3_FILTER
  Top 0.406: 30.96,104.14 C8.1 32.13,100.94 32.13,93.6 35.31,90.42 40.64,90.42 42.8,88.27 U2.6 42.8,87.74 42.67,87.87 | 30.96,104.14 R24.1 | D7.C 30.96,104.14 | D5.A 30.96,104.14
CELL_4
  Top 0.406: CHARGE_SENSE1.5 CHARGE_SENSE.5 41.91,113.79 37.85,109.73 35.31,109.73 34.8,109.22 34.8,108.48 R23.2
CELL_4_FILTER
  Top 0.406: 34.77,104.14 C7.1 33.14,100.47 33.14,93.61 35.76,90.98 40.87,90.98 44.07,87.78 U2.7 44.2,87.6 | 34.77,104.14 R23.1 | D5.C 34.77,104.14 | D4.A 34.77,104.14
CELL_5
  Top 0.406: CHARGE_SENSE1.6 CHARGE_SENSE.6 44.45,114.32 R22.2
CELL_5_FILTER
  Top 0.406: 38.58,104.14 C6.1 38.87,102.11 40.64,100.33 40.64,95.25 41.53,94.36 U2.12 | 38.58,104.14 R22.1 | D4.C 38.58,104.14 | D1.A 38.58,104.14
CELL_6
  Top 0.406: CHARGE_SENSE1.7 CHARGE_SENSE.7 46.99,113.05 R21.2
CELL_6_FILTER
  Top 0.406: 42.39,104.14 R21.1 | 42.39,104.14 C5.1 42.67,102.11 43.69,101.09 43.69,94.49 42.8,93.6 U2.11 42.67,93 | D1.C 42.39,104.14 | D2.A 42.39,104.14
CELL_7
  Top 0.406: CHARGE_SENSE1.8 CHARGE_SENSE.8 49.53,111.78 R20.2
CELL_7_FILTER
  Top 0.406: 43.94,93 U2.10 44.07,93.6 44.96,94.49 44.96,101.09 45.97,102.11 C4.1 46.2,104.11 | 46.2,104.11 R20.1 | 46.17,104.14 D2.C | 46.17,104.14 46.2,104.11 | D3.A 46.17,104.14
CELL_8
  Top 0.406: CHARGE_SENSE1.9 CHARGE_SENSE.9 52.07,110.51 R19.2
CELL_8_FILTER
  Top 0.406: 50.01,104.14 C3.1 50.01,102.08 48.26,100.33 48.26,95.79 U2.9 45.34,91.82 44.2,90.68 | 50.01,104.14 R19.1 | D3.C 50.01,104.14 | 44.2,90.68 42.14,90.68 40.87,91.95 40.87,91.97 40.26,92.58 U2.13 | 44.2,90.68 45.72,90.68 46.62,90.68 C1.1
FAN_CTL_1
  Top 0.406: U3.1.6 85.72,34.92 87.63,33.02 90.22,33.02 Q7.1
  Top 0.61: Q7.1 94.82,34.4 R46.1
FAN_CTL_2
  Top 0.406: U3.1.7 81.92,32.38 87.63,26.67 87.63,24.13 88.9,22.86 90.17,22.86 91.55,24.24 Q8.1
  Top 0.61: Q8.1 94.57,24.24 R47.1
FAN_CTL_3
  Top 0.406: R48.1 95.58,13.51 | Q9.1 91.55,14.08 90.17,12.7 88.9,12.7 87.63,13.97 87.63,17.14 U3.3.6
  Top 0.61: Q9.1 95.01,14.08 95.58,13.51
FAN_CTL_4  (via drill 0.6)
  Top 0.406: Q10.1 91.55,3.92 90.17,2.54 87.63,2.54 86.36,3.81 v86.36,7.62 | U3.3.7 86.36,15.88 v86.36,12.7
  Top 0.61: Q10.1 94.82,3.92 R49.1
  Bottom 0.406: v86.36,12.7 v86.36,7.62
GND  (via drill 0.35, 0.6)
  Top 0.406: 62.23,110.49 62.23,110.3
  other vias: 92.71,26.67 49.78,98.55 46.23,98.55 42.42,98.55 34.8,98.55 23.37,98.55 27.18,98.55 30.99,98.55 52.07,68.58 68.58,58.42 61.21,96.52 52.07,69.85 38.61,98.55 92.71,36.83 20.32,106.68 2.57,103.92 48.39,87.76 68.58,68.58 92.96,16.26 92.96,6.1 31.5,2.03 66.04,113.03 66.29,39.88 76.2,68.58 71.88,116.84 72.39,121.92 34.29,86.36 64.52,109.22 53.34,60.96 106.68,34.29 100.33,27.94 24.13,2.03 2.54,8.89 2.54,15.24 2.54,21.59 2.54,27.94 2.54,34.29 2.54,40.64 2.54,46.99 2.54,53.34 2.54,59.69 2.54,66.04 2.54,72.39 2.54,78.74 2.54,85.09 2.54,91.44 2.54,97.79 2.54,110.49 21.59,121.92 111.76,57.15 111.76,50.8 111.76,44.45 111.76,38.1 111.76,31.75 111.76,25.4 111.76,19.05 111.76,12.7 111.76,8.89 105.41,2.54 99.06,2.54 84.58,2.03 39.5,73.79 38.86,2.03 46.48,2.03 54.1,2.03 61.72,2.03 69.34,2.03 76.96,2.03 39.62,83.57 42.16,83.57 2.54,116.84 2.54,121.92 8.89,121.92 15.24,121.92 61.72,113.03 61.21,99.82 61.21,91.44 16.51,2.03 8.89,2.03 2.54,2.03 50.8,77.47 7.87,50.8 24.64,51.56 26.67,45.47 20.32,71.12 17.78,66.04 27.94,68.83 25.4,66.04 25.4,60.96 17.78,60.96 45.21,70.61 37.08,77.22
  pour Bottom (rank 2): 119.38,127 -2.54,127 -2.54,-5.08 119.38,-5.08
  pour Top (rank 2): 119.38,127 -2.54,127 -2.54,-5.08 119.38,-5.08
LOGIC_POWER
  Top 0.406: OKI-78SR-3V1.1 57.15,53.09 64.2,46.04 R2.2
  Top 0.813: OKI-78SR-5V.1 57.92,70.36 F1.P$2 57.92,63.76 OKI-78SR-3V1.1 50.43,62.99 C15.+ C16.+
LOGIC_SWITCH
  Top 0.406: R4.1 59.61,108.82 Q1.1 57.8,108.82 56.9,109.73 56.9,110.24 56.39,110.74 54.36,110.74 53.85,110.24 53.85,100.33 52.07,98.55 52.07,83.31 42.16,73.41 42.16,65.79 | U3.3.5 63.63,27.3 59.69,31.24 59.69,48.26 42.16,65.79 | 42.16,65.79
N$1
  Top 0.406: J2.1 100.08,58.67 J4.1
N$2
  Top 0.406: Q5.3 66.42,119 66.04,119.38 66.04,121.6 R18.2
N$3
  Top 0.406: U2.3 38.99,85.64 C14.1
N$4
  Top 0.406: LOG_PWR_LED.C R9.1
N$5
  Top 0.406: U1.4 73.66,71.83 | 73.66,71.83 80.57,71.83 90.17,62.23 93.98,62.23 J2.2 | R3.2 73.66,71.83
N$6
  Top 0.406: C22.1 33.83,77.36 U$3.4
N$7
  Top 0.406: Q1.3 55.97,105.5 LOGIC_PWR.1
N$8
  Top 0.406: C13.1 16.09,44.08 U5.4
N$9
  Top 0.406: R18.1 V_OUT_LED.C
N$10
  Top 0.406: R13.2 R14.1 76.13,120.84 75.44,120.14 73.41,120.14 71.63,118.36 69.39,118.36 Q5.1 68.53,118.94 68.53,121.92 D6.C
N$11
  Top 0.406: R7.1 R8.2 100.01,50.8 96.52,50.8 95,52.32 J4.3
N$12
  Top 0.406: C13.2 16.09,42.28 U5.5
N$14
  Top 0.406: U5.2 17.14,46.35 17.78,46.99 17.78,48.88 C17.1
N$15
  Top 0.813: F1.P$1 64.52,104.39 LOGIC_PWR.4
N$22
  Top 0.406: U2.8 45.21,87.34 R5.2
N$34
  Top 0.406: Q4.1 82.3,93.98 80.77,92.46 | 80.77,92.46 80.77,79.76 78.74,77.72 72.39,77.72 U1.5 | Q3.1 82.55,105.41 80.77,103.63 80.77,92.46
N$40
  Top 0.406: C12.1 16.11,47.38 U5.1
N$41  (via drill 0.6)
  Top 0.406: U1.8 67.89,75.62 68.58,74.93 69.85,74.93 70.42,75.5 U1.6 70.42,79.89 C2.1 70.8,80.33 70.36,80.77 70.36,83.31 v69.85,83.82
  Top 0.61: 70.48,80.58 C2.1
  Bottom 0.813: LOGIC_PWR.3 60.96,104.39 62.48,102.87 v69.85,102.87 | 70.1,100.33 70.61,99.82 70.61,98.55 v69.85,97.79
  other vias: 69.85,113.03 69.85,107.95 69.85,92.71 69.85,88.39 78.74,83.82 78.74,90.17
  pour Bottom (isolate 0.406, no thermals): 80.01,82.55 68.58,82.55 68.58,114.3 80.01,114.3
  pour Top (isolate 0.406, no thermals): 68.58,82.55 80.01,82.55 80.01,114.3 68.58,114.3
N$42
  Top 0.406: C12.2 15.85,45.58 U5.3
N$45
  Top 0.406: C18.1 19.9,45.72 19.9,44.55 19.9,44.29 17.93,42.33 17.93,41.81 17.4,41.27 U5.6
N$63
  Top 0.406: Q6.3 103.79,30.48 IC2.P$1
N$66
  Top 0.61: Q7.3 89.75,37.3 FAN_1.2
N$70
  Top 0.61: Q8.3 89.75,27.14 FAN_2.2
N$71
  Top 0.61: Q9.3 89.75,16.98 FAN_3.2
N$72
  Top 0.61: Q10.3 89.75,6.82 FAN_4.2
PACK_GATE
  Bottom 0.406: J4.2 99.06,52.32 99.06,45.72 96.52,43.18 80.64,43.18 U3.3.0
PACK_I_MEAS
  Top 0.406: U3.5.0 78.74,31.11 78.74,58.42 82.67,62.35 U4.3
RC_FILTER
  Top 0.406: U$3.6 29.26,74.12 30.53,72.85 U$3.2 33.98,72.85 34.29,73.15 39.37,68.07 R12.2
RS232_RX_PB
  Top 0.406: U5.13 21.44,43.81 19.05,41.42 19.05,37.63 17.91,36.49 RS232_PB.3
RS232_TX_PB
  Top 0.406: RS232_PB.2 20.45,31.88 19.05,30.48 17.78,30.48 16.51,31.75 16.51,35.88 18.49,37.87 18.49,42.1 20.45,44.06 20.45,44.45 21.09,45.09 U5.14 21.48,45.09
SER_RX_PB
  Top 0.406: U5.12 U3.3.2
SER_TX_IND
  Top 0.406: J1.3 D10.C
  Bottom 0.406: U3.9.7 58.29,3.05 33.27,3.05 29.72,6.6 29.72,43.89 27.53,46.08 27.53,46.12 18.02,55.63 J1.3
SER_TX_PB
  Top 0.406: U5.11 33.02,41.27 U3.3.3
TEMP_1
  Top 0.406: U3.2.5 80.64,45.72 92.71,45.72 93.98,46.99 TEMP_1.2
V_CHECK_ARRAY
  Top 0.406: U3.5.1 77.34,29.72 65.28,29.72 62.3,32.7 R1.2 R2.1
V_CHECK_OUT  (via drill 0.6)
  Top 0.406: R10.2 R11.1 76.13,117.03 74.42,115.32 69.09,115.32 68.07,114.3 68.07,99.57 v66.55,98.04 | v54.86,98.04 54.1,97.28 54.1,83.82 43.18,72.9 43.18,66.04 60.96,48.26 60.96,32 64.52,28.45 78.87,28.45 U3.5.2
  Bottom 0.406: v66.55,98.04 v54.86,98.04
V_IN  (via drill 0.6)
  other vias: 111.76,90.17 106.68,90.17 101.6,90.17 96.52,90.17 90.17,90.17 111.76,85.09 111.76,80.01 111.76,74.93 111.76,69.85 101.6,67.31 96.52,67.31 91.44,67.31 86.36,68.58 82.55,72.39 82.55,77.47 82.55,82.55 106.68,67.31 111.76,67.31
  pour Bottom (isolate 0.406, no thermals): 81.28,91.44 121.92,91.44 121.92,66.04 87.63,66.04 81.28,72.39
  pour Top (isolate 0.406, no thermals): 81.28,91.44 121.92,91.44 121.92,66.04 87.63,66.04 81.28,72.39
V_OUT  (via drill 0.6)
  Top 0.406: R13.1 R10.1 82.42,118.24 v87.63,113.03 | 83.82,114.3 85.09,114.3 v87.63,111.76 | V_OUT.P$1 101.6,106.68 113.08,95.2 113.08,62.28 107.63,56.83 R8.1
  Bottom 0.406: 101.6,106.68 V_OUT.P$1
  other vias: 87.63,95.25 87.63,96.52 87.63,99.06 87.63,100.33 87.63,101.6 87.63,106.68 87.63,107.95 87.63,110.49 111.76,93.98 111.76,100.08 111.76,105.66 106.68,93.98 101.6,93.98 96.52,93.98 89.92,93.98 106.68,121.92 111.76,121.92 111.76,116.33 101.6,121.92 111.76,110.74 92.46,115.06 94.74,117.09
  pour Bottom (isolate 0.406): 82.55,114.3 90.17,114.3 93.98,118.11 93.98,128.27 121.92,128.27 121.92,92.71 82.55,92.71
  pour Top (isolate 0.406, no thermals): 82.55,114.3 90.17,114.3 93.98,118.11 93.98,128.27 121.92,128.27 121.92,92.71 82.55,92.71

### Text on the board
tPlace: E_STOP | SER_IND | Missouri S&T / Mars Rover Design Team / Battery Managment System / 2018 Rev. 2 / Ellis Sansone / Joseph Hall | BUZZER